# EAGLE design doorball (EAGLE 9.6.1)
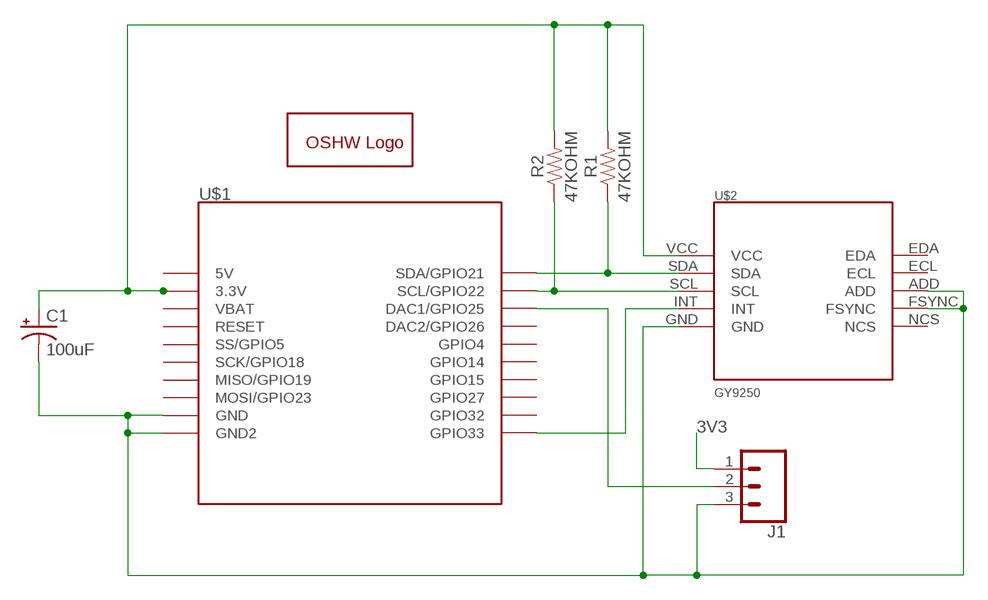
[diagram p0: schematic, sheet 1]

## Parts
C1  100uF  100UF-POLAR-RADIAL-2.5MM-25V-20%  [CPOL-RADIAL-2.5MM-6.5MM]
GOLD_ORB_SM1  OSHWLOGOLOGO5MM  [OSHW_5MM]
J1  CONN_03  [1X03]
R1  47KOHM  [AXIAL-0.3-KIT]
R2  47KOHM  [AXIAL-0.3-KIT]
U$1  ESP23-TINY-PICO  [ESP32-TINY-PICO]
U$2  GY9250  [GY9250BREAKOUT]

## Nets
3V3: C1.1(+) J1.1 R1.P$2 R2.P$2 U$1.3.3V U$2.VCC
GND: C1.2(-) J1.3 U$1.GND U$1.GND@2(GND2) U$2.ADD U$2.FSYNC U$2.GND
N$1: R1.P$1 U$1.SDA/GPIO21 U$2.SDA
N$2: R2.P$1 U$1.SCL/GPIO22 U$2.SCL
N$3: J1.2 U$1.DAC1/GPIO25
N$4: U$1.GPIO33 U$2.INT
Unconnected: U$1.DAC2/GPIO26 U$1.GPIO4 U$1.GPIO14 U$1.GPIO15 U$1.GPIO27 U$1.GPIO32 U$1.MISO/GPIO19 U$1.MOSI/GPIO23 U$1.RESET U$1.SCK/GPIO18 U$1.SS/GPIO5 U$1.VBAT U$2.ECL U$2.EDA U$2.NCS

## Power pins joined to a net without a drawn wire
5V: U$1.5V

## Library data of the parts
C1 = LOLIN32:100UF-POLAR: 100µF polarized capacitors A capacitor is a passive two-terminal electrical component used to store electrical energy temporarily in an electric field.; PROD_ID: CAP-08439
GOLD_ORB_SM1 = oshw:OSHWLOGO: The OSHW logo for PCB layout
J1 = SparkFun-Connectors:CONN_03: Multi connection point. Often used as Generic Header-pin footprint for 0.1 inch spaced/style header connections On any of the 0.1 inch spaced packages, you can populate with these: Break Away Headers - Straight <https://www.sparkfun.com/products/116> (PRT-00116) Break Away Male Headers - Right Angle <https://www.sparkfun.com/products/553> (PRT-00553) Female Headers <https://www.sparkfun.com/products/115> (PRT-00115) Break Away Headers - Machine Pin <https://www.sparkfun.com/products/117> (PRT-00117) Break Away Female Headers - Swiss Machine Pin <https://www.sparkfun.com/products/743> (PRT-00743) Stackable Header - 3 Pin (Female, 0.1") <https://www.sparkfun.com/products/13875> (PRT-13875) For SCREWTERMINALS and SPRING TERMINALS visit here: Screw Terimnals on SparkFun.com <https://www.sparkfun.com/search/results?term=Screw+Terminals> (5mm/3.5mm/2.54mm spacing) This device is also useful as a general connection point to wire up your design to another part of your project. Our various solder wires solder well into these plated through hole pads. Hook-Up Wire - Assortment (Stranded, 22 AWG) <https://www.sparkfun.com/products/11375> (PRT-11375) Hook-Up Wire - Assortment (Solid Core, 22 AWG) <https://www.sparkfun.com/products/11367> (PRT-11367) View the entire wire category on our website here <https://www.sparkfun.com/categories/141> Special notes: Molex polarized connector foot print use with SKU : PRT-08232 with associated crimp pins and housings.
R1 R2 = LOLIN32:47KOHM: 47kΩ resistor A resistor is a passive two-terminal electrical component that implements electrical resistance as a circuit element. Resistors act to reduce current flow, and, at the same time, act to lower voltage levels within circuits. - Wikipedia
U$1 = LOLIN32:ESP23-TINY-PICO: ESP32 TinyPico breakout board
U$2 = LOLIN32:GY9250

## Board
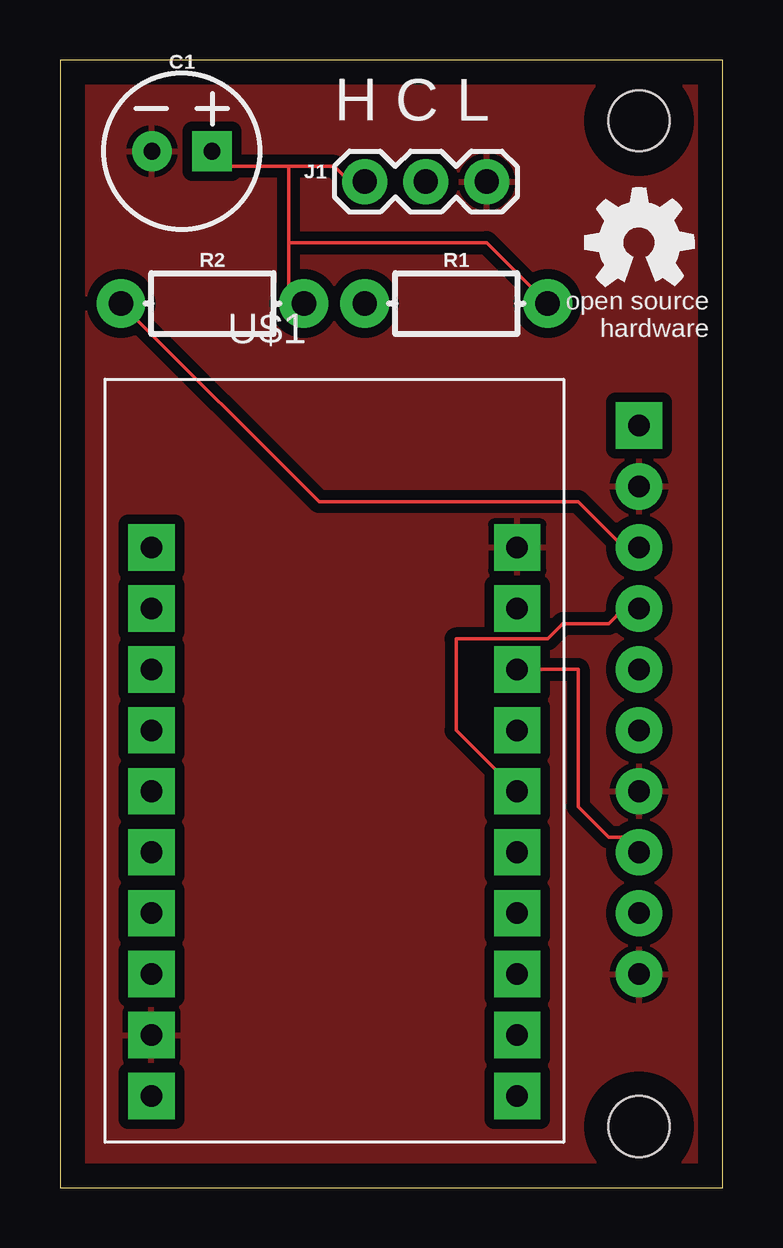
[diagram p1: board, top side]
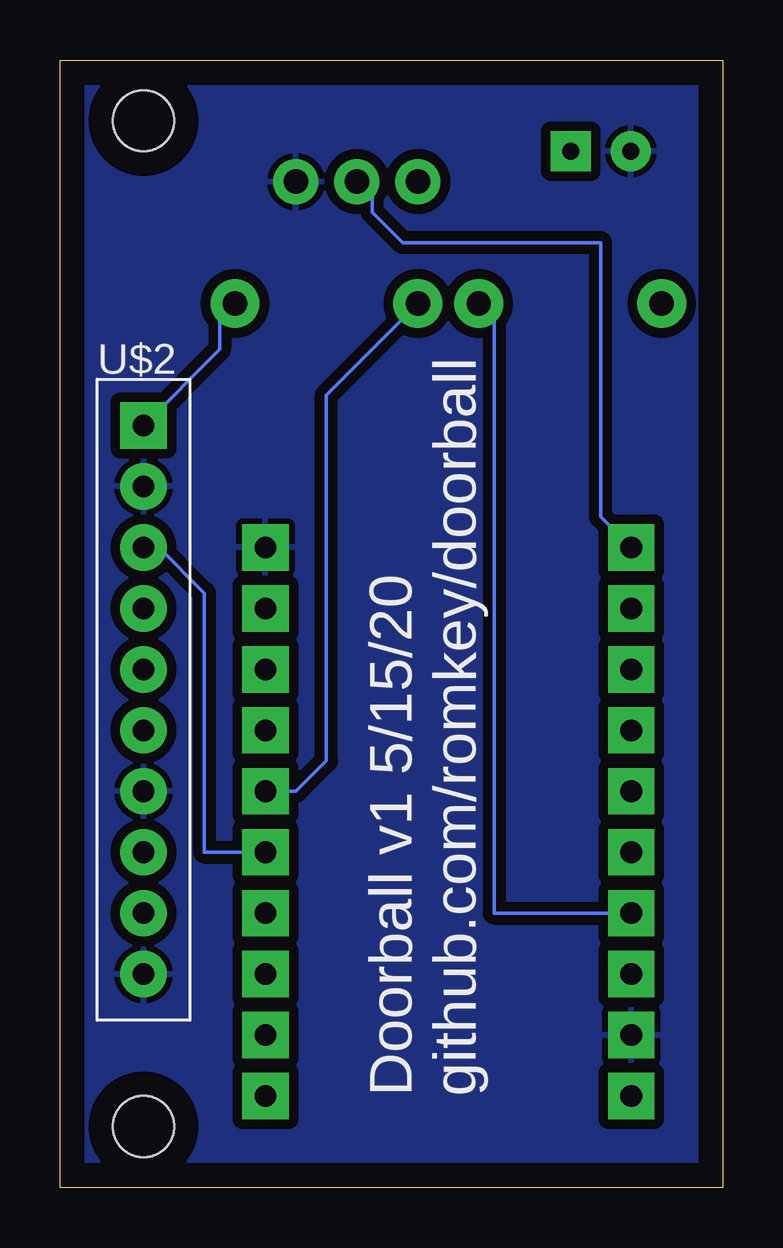
[diagram p2: board, bottom side, seen from below]

Size 27.61 x 46.98 mm. Coordinates in mm from the lower left corner, seen from the top.
Outline: 0,0 27.61,0 27.61,46.98 0,46.98 0,0
Copper layers (1*16): Top 0.035mm / dielectric 1.5mm / Bottom 0.035mm
Design rules "default": minimum track width 6mil, minimum drill 0.35mm, track to track 6mil, track to pad 6mil, pad to pad 6mil, via to via 6mil, smd to smd 6mil, copper to edge 40mil, drill to drill 6mil, minimum pad ring 10mil, minimum via ring 8mil, stop-mask expansion 4mil, vias tented up to drill 0mil, thermal gap 10mil
Holes 2.54 mm at 24.13,2.54 24.13,44.45

### Footprints (pad centres in the part's own frame; a part is rotated, then mirrored left to right if it is on the bottom)
CPOL-RADIAL-2.5MM-6.5MM = drill 0.7 pad 1.651 square: 1 1.25,0 | drill 0.7 pad 1.651: 2 -1.25,0
1X03 = drill 1.016 pad 1.88: 1 0,0; 2 2.54,0; 3 5.08,0
AXIAL-0.3-KIT = drill 1.016 pad 2.032: P$1 -3.81,0; P$2 3.81,0
ESP32-TINY-PICO = drill 0.9 pad 1.93 square: 3.3V -8.89,-3.81; 5V -8.89,-6.35; DAC1/GPIO25 -8.89,11.43; DAC2/GPIO26 -8.89,8.89; GND -8.89,-8.89; GND@2 6.35,11.43; GPIO4 -8.89,-1.27; GPIO14 -8.89,1.27; GPIO15 -8.89,3.81; GPIO27 -8.89,6.35; GPIO32 6.35,3.81; GPIO33 6.35,6.35; MISO/GPIO19 6.35,-8.89; MOSI/GPIO23 6.35,-11.43; RESET 6.35,8.89; SCK/GPIO18 6.35,-6.35; SCL/GPIO22 6.35,-1.27; SDA/GPIO21 6.35,1.27; SS/GPIO5 6.35,-3.81; VBAT -8.89,-11.43
GY9250BREAKOUT = drill 0.9 pad 1.93: ADD 2.54,10.16; ECL 2.54,12.7; EDA 2.54,15.24; FSYNC 2.54,2.54; GND 2.54,22.86; INT 2.54,7.62; NCS 2.54,5.08; SCL 2.54,20.32; SDA 2.54,17.78 | drill 0.9 pad 1.93 square: VCC 2.54,25.4

### Placement (x,y rotation side)
C1  5.08,43.18 0 top
GOLD_ORB_SM1  24.13,39.37 0 top
J1  12.7,41.91 0 top
R1  16.51,36.83 0 top
R2  6.35,36.83 0 top
U$1  12.7,15.24 0 top
U$2  26.67,6.35 0 bottom

### Tracks (layer width: path | path; a pad name or v marks a point on that pad's centre or on a via)
3V3
  Top 0.152: 9.53,42.55 11.43,42.55 12.06,41.91 J1.1 | 9.53,42.55 6.99,42.55 6.35,43.18 C1.1 | 9.53,39.37 9.53,36.83 R2.P$2 | 9.53,39.37 9.53,42.55 | R1.P$2 17.78,39.37 9.53,39.37
  Bottom 0.152: U$2.VCC 20.95,34.92 20.95,36.2 R1.P$2 | U$1.3.3V 9.53,11.43 9.53,36.2 R2.P$2
GND
  pour Top (isolate 0.406): 0,46.99 0,0 27.94,0 27.94,46.99
  pour Bottom (isolate 0.406): 0,46.99 0,0 27.94,0 27.94,46.99 1.27,46.99
N$1
  Top 0.152: U$1.SDA/GPIO21 16.51,19.05 16.51,22.86 20.32,22.86 20.95,23.5 22.86,23.5 23.5,24.13 U$2.SDA
  Bottom 0.152: R1.P$1 16.51,33.02 16.51,17.78 17.78,16.51 U$1.SDA/GPIO21
N$2
  Top 0.152: R2.P$1 10.79,28.57 21.59,28.57 23.5,26.67 U$2.SCL
  Bottom 0.152: U$1.SCL/GPIO22 21.59,13.97 21.59,24.77 23.5,26.67 U$2.SCL
N$3
  Bottom 0.152: J1.2 14.61,41.27 14.61,40.64 13.34,39.37 5.08,39.37 5.08,27.94 U$1.DAC1/GPIO25
N$4
  Top 0.152: U$2.INT 23.5,14.61 22.86,14.61 21.59,15.88 21.59,21.59 U$1.GPIO33

### Text on the board
tPlace: H | C | L
bPlace: Doorball v1 5/15/20 / github.com/romkey/doorball